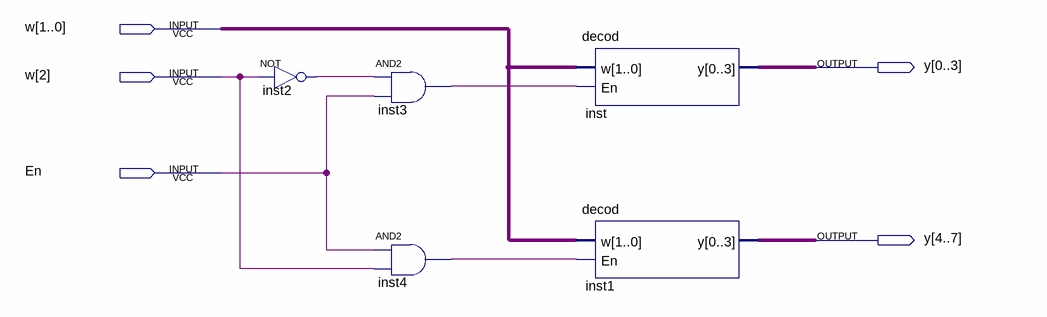
[diagram p0: schematic sheet]
// Quartus schematic decodModified.bdf as structural Verilog: 5 symbols, 5 pins
module decodModified (
  input  [2:0] w,
  input  En,
  output [0:7] y
);

  wire inst2_out, inst3_out, inst4_out;

  not inst2 (inst2_out, w[2]);
  and inst3 (inst3_out, inst2_out, En);
  and inst4 (inst4_out, En, w[2]);
  decod inst (.w(w[1:0]), .En(inst3_out), .y(y[0:3]));
  decod inst1 (.w(w[1:0]), .En(inst4_out), .y(y[4:7]));
endmodule
